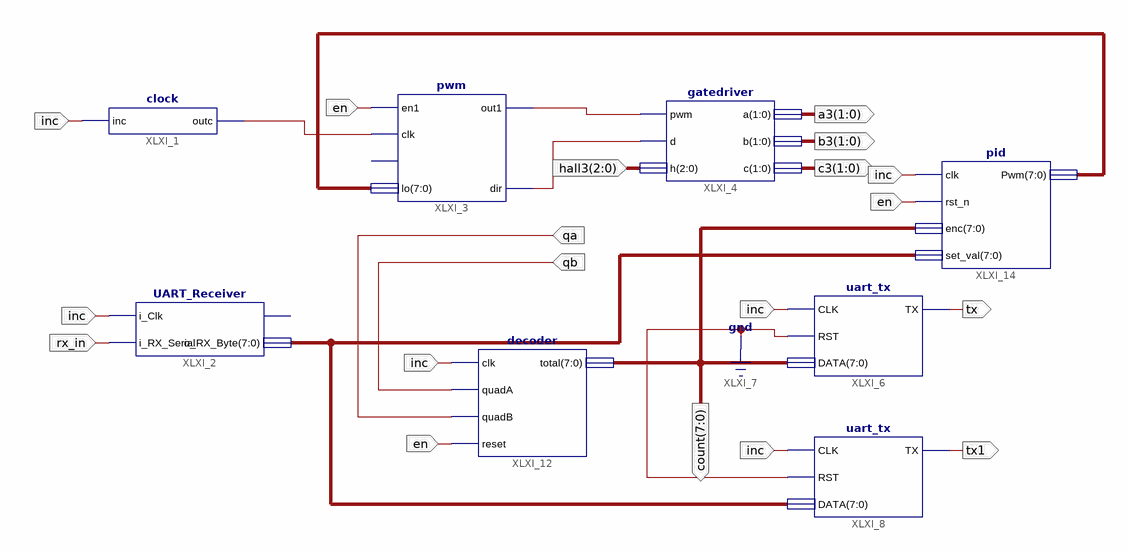
[diagram p0: schematic sheet 1]
// Xilinx ISE schematic motor.sch (spartan6) as structural Verilog: 8 symbols, 12 ports
module motor (
  input  inc,
  input  en,
  input  [2:0] hall3,
  input  rx_in,
  input  qb,
  input  qa,
  output [1:0] a3,
  output [1:0] b3,
  output [1:0] c3,
  output tx,
  output [7:0] count,
  output tx1
);

  wire XLXN_1, XLXN_36, XLXN_37;
  wire [7:0] XLXN_39, XLXN_40;

  clock XLXI_1 (.inc(inc), .outc(XLXN_1));
  UART_Receiver XLXI_2 (.i_Clk(inc), .i_RX_Serial(rx_in), .o_RX_Byte(XLXN_39));  // open: o_RX_DV
  pwm XLXI_3 (.en1(en), .clk(XLXN_1), .lo(XLXN_40), .out1(XLXN_37), .dir(XLXN_36));  // open: cl
  gatedriver XLXI_4 (.pwm(XLXN_37), .d(XLXN_36), .h(hall3), .a(a3), .b(b3), .c(c3));
  uart_tx XLXI_6 (.CLK(inc), .RST(1'b0), .DATA(count), .TX(tx));
  uart_tx XLXI_8 (.CLK(inc), .RST(1'b0), .DATA(XLXN_39), .TX(tx1));
  decoder XLXI_12 (.clk(inc), .quadA(qb), .quadB(qa), .reset(en), .total(count));
  pid XLXI_14 (.clk(inc), .rst_n(en), .enc(count), .set_val(XLXN_39), .Pwm(XLXN_40));
endmodule
